# Altium schematic sheet Power Supplies and regulator.SchDoc: POWER SUPPLY
size A4; Date: *******; ApprovedBy: *******; CheckedBy: None; Author: *******; CompanyName: *******; DrawnBy: Name; Engineer: *******; Organization: *******; Address1: *******; Address2: *******; Address3: *******; Address4: *******; DocumentNumber: 5; Revision: *******; SheetNumber: 5; SheetTotal: 11; CurrentTime: *******; CurrentDate: *******; Time: *******; DocumentFullPathAndName: *******; DocumentName: *******; ModifiedDate: *******; ImagePath: *******; ProjectName: *******; Application_BuildNumber: *******
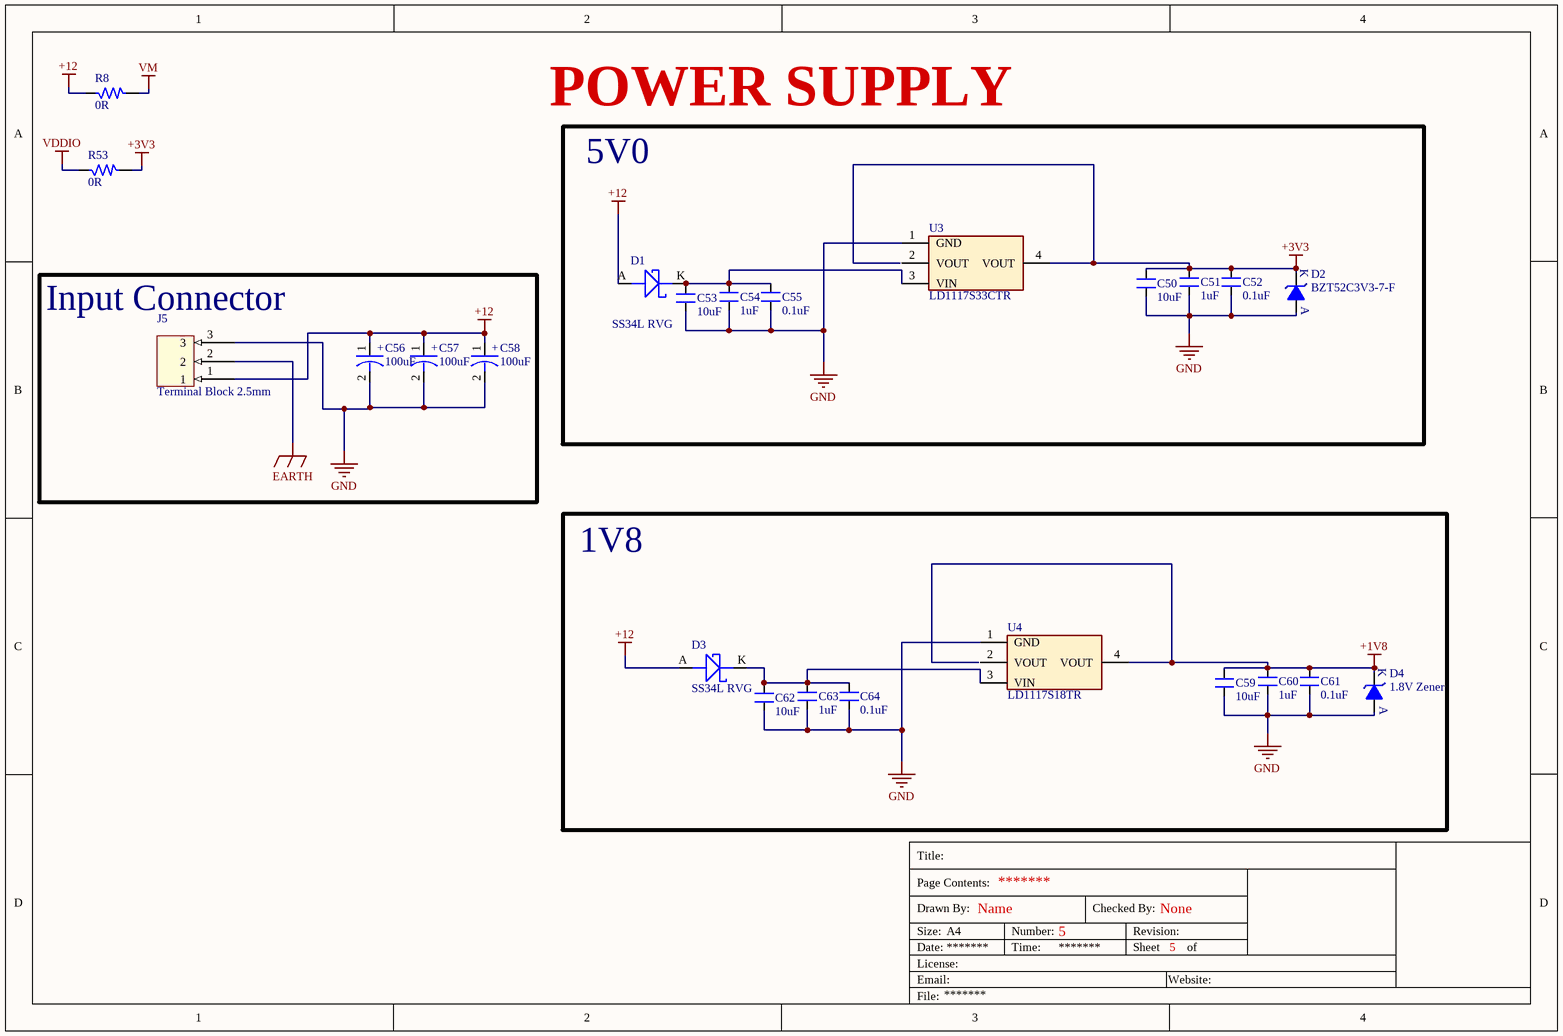
[diagram p0: Power Supplies and regulator.SchDoc]

## Parts
C50  10uF  [CAP_1206]
C51  1uF  [CAP_0805]
C52  0.1uF  [CAP_0805]
C53  10uF  [CAP_1206]
C54  1uF  [CAP_0805]
C55  0.1uF  [CAP_0805]
C56  100uF  [ACAP_P236_D305_H303_RAD]
C57  100uF  [ACAP_P236_D305_H303_RAD]
C58  100uF  [ACAP_P236_D305_H303_RAD]
C59  10uF  [CAP_1206]
C60  1uF  [CAP_0805]
C61  0.1uF  [CAP_0805]
C62  10uF  [CAP_1206]
C63  1uF  [CAP_0805]
C64  0.1uF  [CAP_0805]
D1  SS34L RVG  [DIO_SMB_DO-214AC]
D2  BZT52C3V3-7-F  [DIO_SOD-123]
D3  SS34L RVG  [DIO_SMB_DO-214AC]
D4  1.8V Zener  [DIO_DO-213AB_SMD]
J5  Terminal Block 2.5mm  [CON3_100_TB_TH_ST]
R8  0R  [RES_1206]
R53  0R  [RES_1206]
U3  LD1117S33CTR  [SOT223_3]
U4  LD1117S18TR  [SOT223_3]

## Blocks framed on the sheet
5V0: C50-C55 D1 D2 U3
Input Connector: C56-C58 J5
1V8: C59-C64 D3 D4 U4

## Nets
+1V8: C59.2 C60.2 C61.2 D4.K U4.4(VOUT)
+3V3: C50.2 C51.2 C52.2 D2.K R53.2 U3.4(VOUT)
+12: C56.1 C57.1 C58.1 D1.A D3.A J5.1 R8.1
EARTH: J5.2
GND: C50.1 C51.1 C52.1 C53.1 C54.1 C55.1 C56.2 C57.2 C58.2 C59.1 C60.1 C61.1 C62.1 C63.1 C64.1 D2.A D4.A J5.3 U3.1(GND) U4.1(GND)
VDDIO: R53.1
VM: R8.2
NetC53_2: C53.2 C54.2 C55.2 D1.K U3.3(VIN)
NetC62_2: C62.2 C63.2 C64.2 D3.K U4.3(VIN)

Not connected (* = marked no-connect by the designer): U3 2(VOUT); U4 2(VOUT)

## Notes on the sheet
- Title:
- Drawn By:
- Page Contents:
- Checked By:
- Size:
- Date:
- File:
- License:
- Email:
- A4
- Number:
- Time:
- Revision:
- Sheet
- Website:
- of
- (in symbol CAP-P_100uF-25V-20%-RAD) +

## Library data of the parts
C50 C53 C59 C62 = CAP_10uF-50V-10%-1206: 10µF ±10% 50V Ceramic Capacitor X7R 1206 (3216 Metric); Manufacturer: KEMET; Manufacturer Part Number: CL31B106KBHNNNE; Alternate Part Number-1: GRT31CR61H106ME01L; Case/Package: 1206; Supplier-1: SIRICOM; Supplier Part Number-1: CC1206KKX5R9BB106
C51 C54 C60 C63 = CAP_1uF-50V-5%-0805: 1µF ±5% 50V Ceramic Capacitor X7R 0805 (2012 Metric); Manufacturer: Samsung; Manufacturer Part Number: CC0805JKX7R9BB105; Alternate Part Number-1: 0805F105M500NT; Case/Package: 0805; Supplier-1: SIRICOM; Supplier Part Number-1: CL21B105KBFNNNE
C52 C55 C61 C64 = CAP_0.1uF-50V-5%-0805: 0.1µF ±5% 50V Ceramic Capacitor X7R 0805 (2012 Metric); Manufacturer: AVX Corporation; Manufacturer Part Number: 08055C104JAT4A; Alternate Part Number-1: 0805B104M500; Case/Package: 0805; Supplier-1: SIRICOM; Supplier Part Number-1: 0805B104J500CT
C56-C58 = CAP-P_100uF-25V-20%-RAD: 100µF 25V Aluminum Electrolytic Capacitors Radial, Can - SMD 1000 Hrs @ 105°C; Manufacturer: Nichicon; Manufacturer Part Number: UWT1E101MCL1GS; Alternate Part Number-1: NA; Case/Package: Radial-SMD; Supplier-1: SP ROAD; Supplier Part Number-1: UWT1E101MCL1GS
D1 D3 = DIO-S_550mV-40V-5A-SMC: Diode Schottky 40V 5A Surface Mount SMA; Manufacturer: Multicomp; Alternate Part Number-1: SS34; Manufacturer Part Number: SS34L RVG; Case/Package: SMC; Supplier-1: SIRICOM; Supplier Part Number-1: SS34L RVG
D2 = DIO-Z_3.3V-500mW-SOD123: Zener Diode 3.3V 500mW ±6% Surface Mount SOD-123; Manufacturer: Diodes Incorporated; Alternate Part Number-1: NA; Manufacturer Part Number: BZT52C3V3-7-F; Case/Package: SOD-123; Supplier-1: Digikey; Supplier Part Number-1: BZT52C3V3-FDICT-ND
D4 = DIO-Z_1.8V-500mW-DO213AA: Zener Diode 1.8V 500mW ±5% Surface Mount DO-213AA; Manufacturer: *; Manufacturer Part Number: *; Case/Package: *; Supplier-1: *; Supplier Part Number-1: *; Alternate Part Number-1: *
J5 = CON-TB_3X1-100-ST-TH: 3 Pins, 1 Row 2.54mm Pitch, straight Connector, male; Manufacturer Part Number: 1725669; Manufacturer: Phoenix Contact; Alternate Part Number-1: NA; Case/Package: TH-CON; Supplier-1: SP ROAD; Supplier Part Number-1: 1725669
R8 R53 = RES_0R-0.25W-1%-1206: 0 Ohms Jumper 0.25W, 1/4W Chip Resistor 1206 (3216 Metric) Automotive AEC-Q200 Thick Film; Manufacturer: Walsin; Manufacturer Part Number: WR12X000PTL; Alternate Part Number-1: NA; Case/Package: 1206; Supplier-1: SIRICOM; Supplier Part Number-1: WR12X000PTL
U3 = REG_15V-3.3V-0.9A-12W-SOT223: Linear Voltage Regulator IC 1 Output 800mA SOT-223; Manufacturer: STMicroelectronics; Alternate Part Number-1: NA; Manufacturer Part Number: LD1117S33CTR; Case/Package: SOT223; Supplier-1: SP ROAD; Supplier Part Number-1: LD1117S33CTR
U4 = REG_15V-1.8V-0.8A-1.4W-SOT223: LDO Voltage Regulators 1.8V 0.8A Positive; Manufacturer: STMicroelectronics; Alternate Part Number-1: NA; Manufacturer Part Number: LD1117S18TR; Case/Package: SOT-223-3; Supplier-1: Mouser; Supplier Part Number-1: 511-LD1117S18-TR